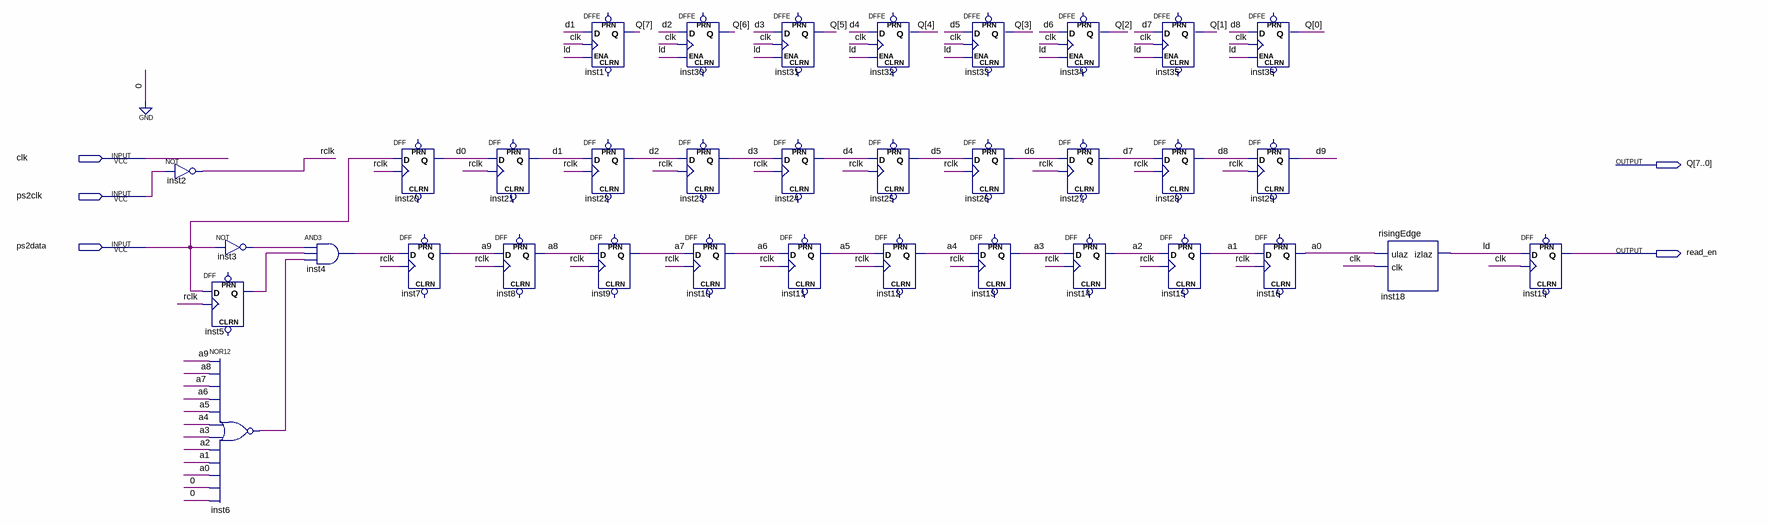
[diagram p0: schematic sheet]
// Quartus schematic ps2controller.bdf as structural Verilog: 35 symbols, 5 pins
module ps2controller (
  input  clk,
  input  ps2clk,
  input  ps2data,
  output [7:0] Q,
  output read_en
);

  wire a0, a1, a2, a3, a4, a5, a6, a7, a8, a9, d0, d1, d2, d3, d4, d5, d6, d7, d8, d9, inst3_out, inst4_out,
       inst5_q, inst6_out, ld, rclk;

  not inst2 (rclk, ps2clk);
  not inst3 (inst3_out, ps2data);
  DFF inst5 (.CLK(rclk), .D(ps2data), .Q(inst5_q));  // open: CLRN, PRN
  nor inst6 (inst6_out, a9, a8, a7, a6, a5, a4, a3, a2, a1, a0, 1'b0, 1'b0);
  and inst4 (inst4_out, inst3_out, inst5_q, inst6_out);
  DFF inst20 (.CLK(rclk), .D(ps2data), .Q(d0));  // open: CLRN, PRN
  DFF inst7 (.CLK(rclk), .D(inst4_out), .Q(a9));  // open: CLRN, PRN
  DFF inst21 (.CLK(rclk), .D(d0), .Q(d1));  // open: CLRN, PRN
  DFF inst8 (.CLK(rclk), .D(a9), .Q(a8));  // open: CLRN, PRN
  DFFE inst1 (.D(d1), .CLK(clk), .ENA(ld), .Q(Q[7]));  // open: PRN, CLRN
  DFF inst22 (.CLK(rclk), .D(d1), .Q(d2));  // open: CLRN, PRN
  DFF inst9 (.CLK(rclk), .D(a8), .Q(a7));  // open: CLRN, PRN
  DFFE inst30 (.D(d2), .CLK(clk), .ENA(ld), .Q(Q[6]));  // open: PRN, CLRN
  DFF inst23 (.CLK(rclk), .D(d2), .Q(d3));  // open: CLRN, PRN
  DFF inst10 (.CLK(rclk), .D(a7), .Q(a6));  // open: CLRN, PRN
  DFFE inst31 (.D(d3), .CLK(clk), .ENA(ld), .Q(Q[5]));  // open: PRN, CLRN
  DFF inst24 (.CLK(rclk), .D(d3), .Q(d4));  // open: CLRN, PRN
  DFF inst11 (.CLK(rclk), .D(a6), .Q(a5));  // open: CLRN, PRN
  DFFE inst32 (.D(d4), .CLK(clk), .ENA(ld), .Q(Q[4]));  // open: PRN, CLRN
  DFF inst25 (.CLK(rclk), .D(d4), .Q(d5));  // open: CLRN, PRN
  DFF inst12 (.CLK(rclk), .D(a5), .Q(a4));  // open: CLRN, PRN
  DFFE inst33 (.D(d5), .CLK(clk), .ENA(ld), .Q(Q[3]));  // open: PRN, CLRN
  DFF inst26 (.CLK(rclk), .D(d5), .Q(d6));  // open: CLRN, PRN
  DFF inst13 (.CLK(rclk), .D(a4), .Q(a3));  // open: CLRN, PRN
  DFFE inst34 (.D(d6), .CLK(clk), .ENA(ld), .Q(Q[2]));  // open: PRN, CLRN
  DFF inst27 (.CLK(rclk), .D(d6), .Q(d7));  // open: CLRN, PRN
  DFF inst14 (.CLK(rclk), .D(a3), .Q(a2));  // open: CLRN, PRN
  DFFE inst35 (.D(d7), .CLK(clk), .ENA(ld), .Q(Q[1]));  // open: PRN, CLRN
  DFF inst28 (.CLK(rclk), .D(d7), .Q(d8));  // open: CLRN, PRN
  DFF inst15 (.CLK(rclk), .D(a2), .Q(a1));  // open: CLRN, PRN
  DFFE inst36 (.D(d8), .CLK(clk), .ENA(ld), .Q(Q[0]));  // open: PRN, CLRN
  DFF inst29 (.CLK(rclk), .D(d8), .Q(d9));  // open: CLRN, PRN
  DFF inst16 (.CLK(rclk), .D(a1), .Q(a0));  // open: CLRN, PRN
  risingEdge inst18 (.ulaz(a0), .clk(clk), .izlaz(ld));
  DFF inst19 (.CLK(clk), .D(ld), .Q(read_en));  // open: CLRN, PRN
endmodule
